# EAGLE design TUR8535 (EAGLE 7.2.0)
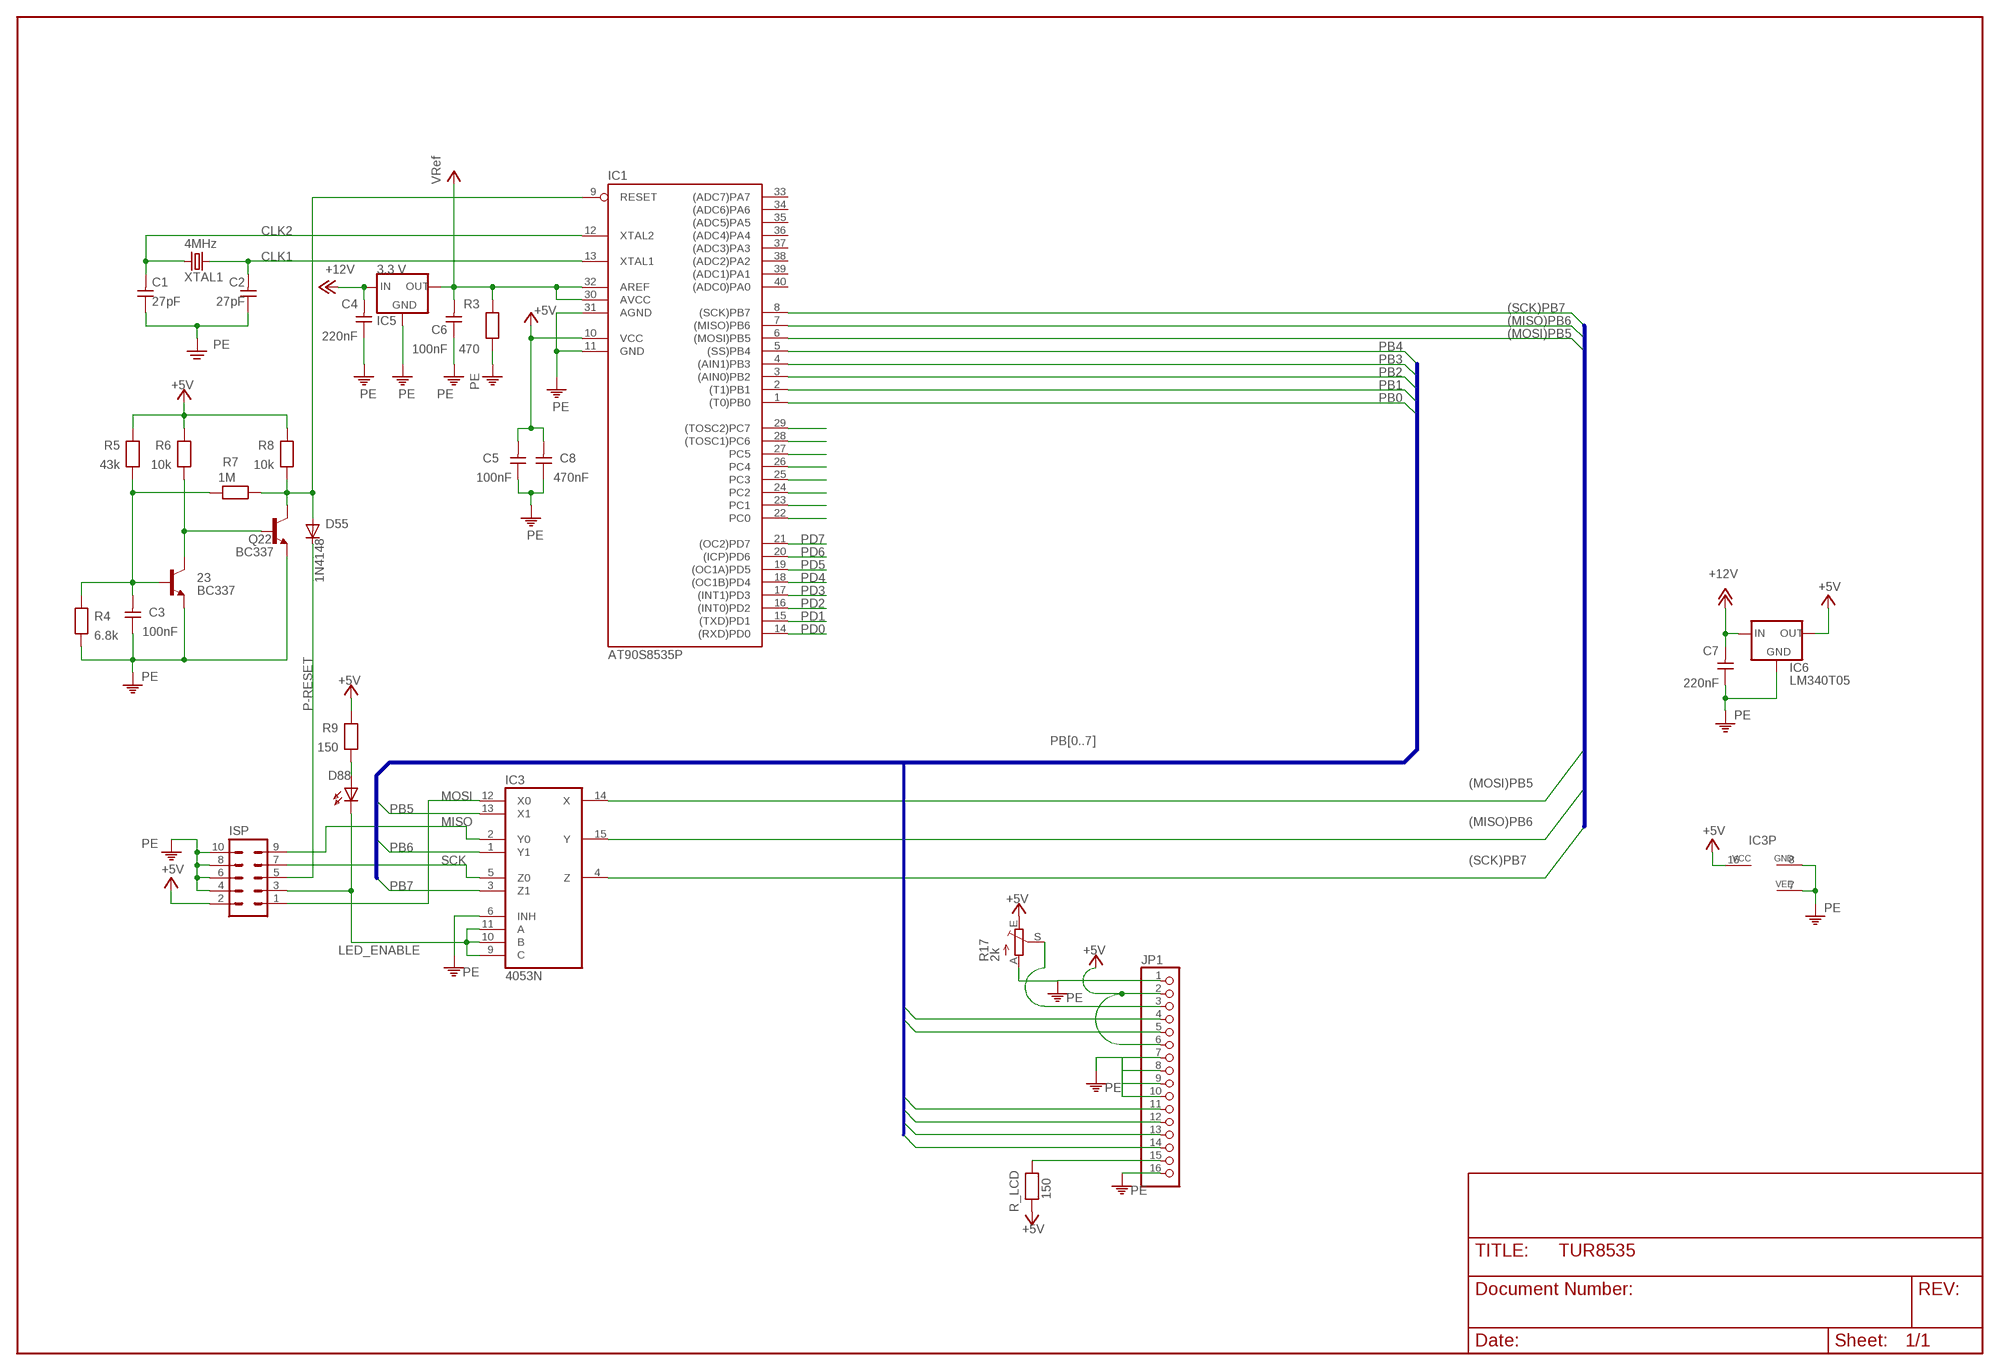
[diagram p0: schematic, sheet 1, part 1 of 2]
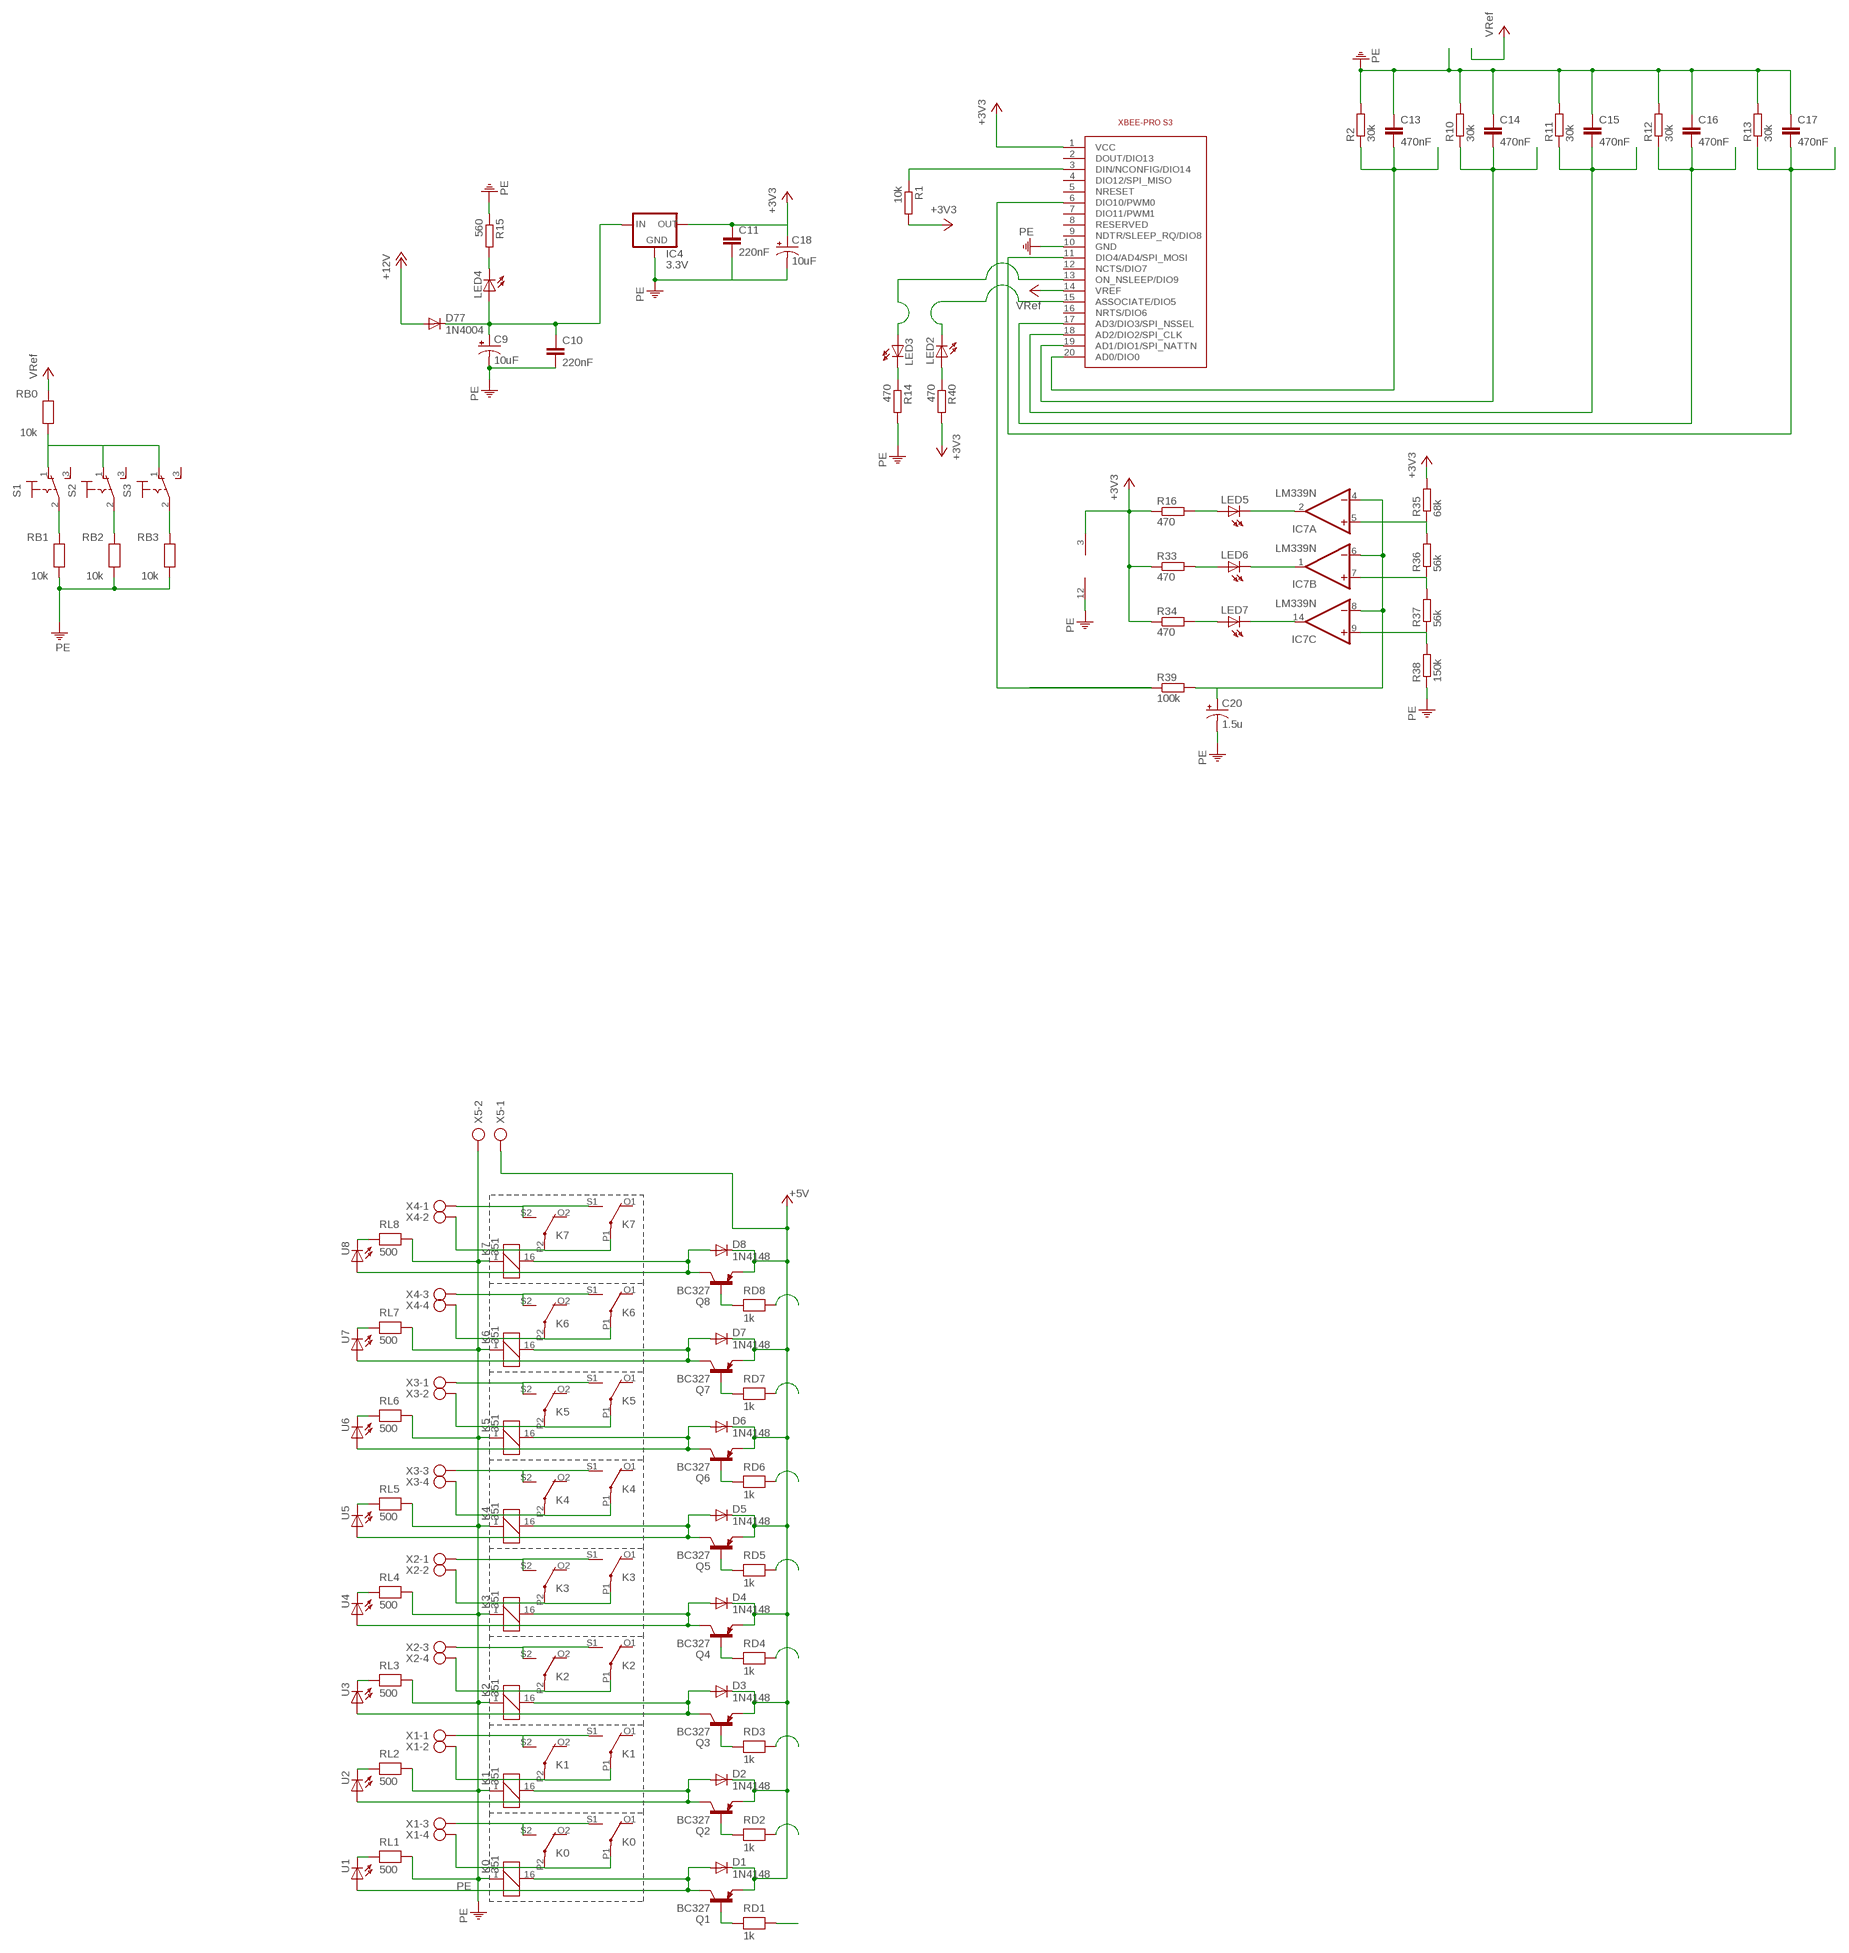
[diagram p1: schematic, sheet 1, part 2 of 2]

## Parts
23  BC337  [TO92]
C1  27pF  CAPNP-5  [C-5]
C2  27pF  CAPNP-5  [C-5]
C3  100nF  CAPNP-5  [C-5]
C4  220nF  CAPNP-5  [C-5]
C5  100nF  CAPNP-5  [C-5]
C6  100nF  CAPNP-5  [C-5]
C7  220nF  CAPNP-5  [C-5]
C8  470nF  CAPNP-5  [C-5]
C9  10uF  CPOL-USE2-5  [E2-5]
C10  220nF  C5/3.5  [C5B3.5]
C11  220nF  C5/3.5  [C5B3.5]
C13  470nF  C5/3.5  [C5B3.5]
C14  470nF  C5/3.5  [C5B3.5]
C15  470nF  C5/3.5  [C5B3.5]
C16  470nF  C5/3.5  [C5B3.5]
C17  470nF  C5/3.5  [C5B3.5]
C18  10uF  CPOL-USE2-5  [E2-5]
C20  1.5u  CPOL-USE2-5  [E2-5]
D1  1N4148  [DO35-10]
D2  1N4148  [DO35-10]
D3  1N4148  [DO35-10]
D4  1N4148  [DO35-10]
D5  1N4148  [DO35-10]
D6  1N4148  [DO35-10]
D7  1N4148  [DO35-10]
D8  1N4148  [DO35-10]
D55  1N4148  [DO35-10]
D77  1N4004  [DO41-10]
D88  LED5MM  [LED5MM]
IC1  AT90S8535P  [DIL40]
IC3  4053N  [DIL16]
IC4  3.3V  78XXL  [78XXL]
IC5  3.3 V  78XXL  [78XXL]
IC6  LM340T05  78XXL  [78XXL]
IC7  LM339N  [DIL14]
ISP  ML10  [ML10]
JP1  PINHD-1X16  [1X16]
K0  351  [351]
K1  351  [351]
K2  351  [351]
K3  351  [351]
K4  351  [351]
K5  351  [351]
K6  351  [351]
K7  351  [351]
LED2  LED3MM  [LED3MM]
LED3  LED3MM  [LED3MM]
LED4  LED5MM  [LED5MM]
LED5  LED3MM  [LED3MM]
LED6  LED3MM  [LED3MM]
LED7  LED3MM  [LED3MM]
Q1  BC327  [TO92-EBC]
Q2  BC327  [TO92-EBC]
Q3  BC327  [TO92-EBC]
Q4  BC327  [TO92-EBC]
Q5  BC327  [TO92-EBC]
Q6  BC327  [TO92-EBC]
Q7  BC327  [TO92-EBC]
Q8  BC327  [TO92-EBC]
Q22  BC337  [TO92]
R1  10k  R-EU_0207/7  [0207/7]
R2  30k  R-EU_0207/7  [0207/7]
R3  470  RESEU-10  [R-10]
R4  6.8k  RESEU-10  [R-10]
R5  43k  RESEU-10  [R-10]
R6  10k  RESEU-10  [R-10]
R7  1M  RESEU-10  [R-10]
R8  10k  RESEU-10  [R-10]
R9  150  RESEU-10  [R-10]
R10  30k  R-EU_0207/7  [0207/7]
R11  30k  R-EU_0207/7  [0207/7]
R12  30k  R-EU_0207/7  [0207/7]
R13  30k  R-EU_0207/7  [0207/7]
R14  470  R-EU_0207/7  [0207/7]
R15  560  R-EU_0207/7  [0207/7]
R16  470  R-EU_0207/7  [0207/7]
R17  2k  TRIM_EU-RJ9W  [RJ9W]
R33  470  R-EU_0207/7  [0207/7]
R34  470  R-EU_0207/7  [0207/7]
R35  68k  R-EU_0207/7  [0207/7]
R36  56k  R-EU_0207/7  [0207/7]
R37  56k  R-EU_0207/7  [0207/7]
R38  150k  R-EU_0207/7  [0207/7]
R39  100k  R-EU_0207/7  [0207/7]
R40  470  R-EU_0207/7  [0207/7]
R_LCD  150  RESEU-10  [R-10]
RB0  10k  RESEU-10  [R-10]
RB1  10k  RESEU-10  [R-10]
RB2  10k  RESEU-10  [R-10]
RB3  10k  RESEU-10  [R-10]
RD1  1k  RESEU-10  [R-10]
RD2  1k  RESEU-10  [R-10]
RD3  1k  RESEU-10  [R-10]
RD4  1k  RESEU-10  [R-10]
RD5  1k  RESEU-10  [R-10]
RD6  1k  RESEU-10  [R-10]
RD7  1k  RESEU-10  [R-10]
RD8  1k  RESEU-10  [R-10]
RL1  500  RESEU-10  [R-10]
RL2  500  RESEU-10  [R-10]
RL3  500  RESEU-10  [R-10]
RL4  500  RESEU-10  [R-10]
RL5  500  RESEU-10  [R-10]
RL6  500  RESEU-10  [R-10]
RL7  500  RESEU-10  [R-10]
RL8  500  RESEU-10  [R-10]
S1  320-916  [320-916]
S2  320-916  [320-916]
S3  320-916  [320-916]
U1  LED3MM  [LED3MM]
U2  LED3MM  [LED3MM]
U3  LED3MM  [LED3MM]
U4  LED3MM  [LED3MM]
U5  LED3MM  [LED3MM]
U6  LED3MM  [LED3MM]
U7  LED3MM  [LED3MM]
U8  LED3MM  [LED3MM]
U$1  XBEEPRO900  [XBEE-PRO]
X1  AK500/4-H  [AK500/4-H]
X2  AK500/4-H  [AK500/4-H]
X3  AK500/4-H  [AK500/4-H]
X4  AK500/4-H  [AK500/4-H]
X5  AK500/2  [AK500/2]
XTAL1  4MHz  CRYTALHC18U-V  [HC18U-V]

## Nets
(MISO)PB6: IC1.7((MISO)PB6) IC3.15(Y)
(MOSI)PB5: IC1.6((MOSI)PB5) IC3.14(X)
(SCK)PB7: IC1.8((SCK)PB7) IC3.4(Z)
+3V3: C11.1 C18.+ IC4.OUT IC7.3(P:V+) R1.2 R16.1 R33.1 R34.1 R35.2 R40.2 U$1.1(VCC)
+5V: C5.2 C8.2 D1.C D2.C D3.C D4.C D5.C D6.C D7.C D8.C IC1.10(VCC) IC3.16(VCC) IC6.OUT ISP.2 JP1.2 JP1.6 Q1.E Q2.E Q3.E Q4.E Q5.E Q6.E Q7.E Q8.E R5.2 R6.2 R8.2 R9.2 R17.E R_LCD.2 X5.1
+12V: C4.2 C7.2 D77.A IC5.IN IC6.IN
CLK1: C2.2 IC1.13(XTAL1) XTAL1.2
CLK2: C1.2 IC1.12(XTAL2) XTAL1.1
DIN: R1.1 U$1.3(DIN/NCONFIG/DIO14)
LED_ENABLE: D88.K(C) IC3.9(C) IC3.10(B) IC3.11(A) ISP.3
MISO: IC3.2(Y0) ISP.9
MOSI: IC3.12(X0) ISP.1
N$1: C17.2 R13.1 U$1.11(DIO4/AD4/SPI_MOSI)
N$2: C9.+ C10.1 D77.C IC4.IN LED4.A
N$3: C13.2 R2.1 U$1.20(AD0/DIO0)
N$4: C14.2 R10.1 U$1.19(AD1/DIO1/SPI_NATTN)
N$5: C15.2 R11.1 U$1.18(AD2/DIO2/SPI_CLK)
N$6: C16.2 R12.1 U$1.17(AD3/DIO3/SPI_NSSEL)
N$7: 23.3(C) Q22.2(B) R6.1
N$8: IC7.2(A:OUT) LED5.K(C)
N$9: 23.2(B) C3.2 R4.2 R5.1 R7.1
N$10: Q8.B RD8.1
N$11: IC7.1(B:OUT) LED6.K(C)
N$12: D7.A K6.16 Q7.C U7.A
N$13: Q6.B RD6.1
N$14: LED3.K(C) R14.1
N$15: LED4.K(C) R15.2
N$16: IC7.14(C:OUT) LED7.K(C)
N$17: D6.A K5.16 Q6.C U6.A
N$18: Q5.B RD5.1
N$19: D88.A R9.1
N$20: D5.A K4.16 Q5.C U5.A
N$21: Q4.B RD4.1
N$22: D4.A K3.16 Q4.C U4.A
N$23: Q3.B RD3.1
N$24: D3.A K2.16 Q3.C U3.A
N$25: Q2.B RD2.1
N$26: K0.P1(2:P) K0.P2(3:P) X1.4
N$27: K1.P1(2:P) K1.P2(3:P) X1.2
N$28: K2.P1(2:P) K2.P2(3:P) X2.4
N$29: K3.P1(2:P) K3.P2(3:P) X2.2
N$30: K4.P1(2:P) K4.P2(3:P) X3.4
N$31: K5.P1(2:P) K5.P2(3:P) X3.2
N$32: K6.P1(2:P) K6.P2(3:P) X4.4
N$33: K7.P1(2:P) K7.P2(3:P) X4.2
N$34: K7.S1(2:S) K7.S2(3:S) X4.1
N$35: JP1.15 R_LCD.1
N$36: K5.S1(2:S) K5.S2(3:S) X3.1
N$37: K4.S1(2:S) K4.S2(3:S) X3.3
N$38: K3.S1(2:S) K3.S2(3:S) X2.1
N$39: K2.S1(2:S) K2.S2(3:S) X2.3
N$40: K1.S1(2:S) K1.S2(3:S) X1.1
N$41: K0.S1(2:S) K0.S2(3:S) X1.3
N$42: K6.S1(2:S) K6.S2(3:S) X4.3
N$43: JP1.3 R17.S
N$44: RB0.1 S1.1(O) S2.1(O) S3.1(O)
N$45: RB1.2 S1.2(P)
N$46: RB2.2 S2.2(P)
N$47: RB3.2 S3.2(P)
N$52: D8.A K7.16 Q8.C U8.A
N$54: Q7.B RD7.1
N$55: LED7.A R34.2
N$56: LED6.A R33.2
N$57: LED5.A R16.2
N$58: IC7.5(A:+IN) R35.1 R36.2
N$59: IC7.7(B:+IN) R36.1 R37.2
N$60: IC7.9(C:+IN) R37.1 R38.2
N$61: C20.+ IC7.4(A:-IN) IC7.6(B:-IN) IC7.8(C:-IN) R39.2
N$62: LED3.A U$1.13(ON_NSLEEP/DIO9)
N$63: R39.1 U$1.6(DIO10/PWM0)
N$64: LED2.K(C) U$1.15(ASSOCIATE/DIO5)
N$65: LED2.A R40.1
N$66: D2.A K1.16 Q2.C U2.A
N$67: Q1.B RD1.1
N$68: D1.A K0.16 Q1.C U1.A
N$96: RL1.1 U1.K(C)
N$163: RL8.1 U8.K(C)
N$165: RL7.1 U7.K(C)
N$169: RL6.1 U6.K(C)
N$171: RL5.1 U5.K(C)
N$174: RL4.1 U4.K(C)
N$177: RL3.1 U3.K(C)
N$180: RL2.1 U2.K(C)
P-RESET: D55.C ISP.5
PB0: IC1.1((T0)PB0) JP1.5
PB1: IC1.2((T1)PB1) JP1.4
PB2: IC1.3((AIN0)PB2)
PB3: IC1.4((AIN1)PB3)
PB4: IC1.5((SS)PB4) JP1.11
PB5: IC3.13(X1) JP1.12
PB6: IC3.1(Y1) JP1.13
PB7: IC3.3(Z1) JP1.14
PC0: IC1.22(PC0) RD8.2
PC1: IC1.23(PC1) RD7.2
PC2: IC1.24(PC2) RD6.2
PC3: IC1.25(PC3) RD5.2
PC4: IC1.26(PC4) RD4.2
PC5: IC1.27(PC5) RD3.2
PC6: IC1.28((TOSC1)PC6) RD2.2
PC7: IC1.29((TOSC2)PC7) RD1.2
PE: 23.1(E) C1.1 C2.1 C3.1 C4.1 C5.1 C6.1 C7.1 C8.1 C9.- C10.2 C11.2 C13.1 C14.1 C15.1 C16.1 C17.1 C18.- C20.- IC1.11(GND) IC1.31(AGND) IC3.6(INH) IC3.7(VEE) IC3.8(GND) IC4.GND IC5.GND IC6.GND IC7.12(P:GND) ISP.4 ISP.6 ISP.8 ISP.10 JP1.1 JP1.7 JP1.8 JP1.9 JP1.10 JP1.16 K0.1 K1.1 K2.1 K3.1 K4.1 K5.1 K6.1 K7.1 Q22.1(E) R2.2 R3.1 R4.1 R10.2 R11.2 R12.2 R13.2 R14.2 R15.1 R17.A R38.1 RB1.1 RB2.1 RB3.1 RL1.2 RL2.2 RL3.2 RL4.2 RL5.2 RL6.2 RL7.2 RL8.2 U$1.10(GND) X5.2
RST: D55.A IC1.9(RESET) Q22.3(C) R7.2 R8.1
SCK: IC3.5(Z0) ISP.7
VCC: C6.2 IC1.30(AVCC) IC1.32(AREF) IC5.OUT R3.2 RB0.2 U$1.14(VREF) ; supply symbol labelled VRef
Unconnected: IC1.14((RXD)PD0) IC1.15((TXD)PD1) IC1.16((INT0)PD2) IC1.17((INT1)PD3) IC1.18((OC1B)PD4) IC1.19((OC1A)PD5) IC1.20((ICP)PD6) IC1.21((OC2)PD7) IC1.33((ADC7)PA7) IC1.34((ADC6)PA6) IC1.35((ADC5)PA5) IC1.36((ADC4)PA4) IC1.37((ADC3)PA3) IC1.38((ADC2)PA2) IC1.39((ADC1)PA1) IC1.40((ADC0)PA0) IC7.10(D:-IN) IC7.11(D:+IN) IC7.13(D:OUT) K0.O1(2:O) K0.O2(3:O) K1.O1(2:O) K1.O2(3:O) K2.O1(2:O) K2.O2(3:O) K3.O1(2:O) K3.O2(3:O) K4.O1(2:O) K4.O2(3:O) K5.O1(2:O) K5.O2(3:O) K6.O1(2:O) K6.O2(3:O) K7.O1(2:O) K7.O2(3:O) S1.3(S) S2.3(S) S3.3(S) U$1.2(DOUT/DIO13) U$1.4(DIO12/SPI_MISO) U$1.5(NRESET) U$1.7(DIO11/PWM1) U$1.8(RESERVED) U$1.9(NDTR/SLEEP_RQ/DIO8) U$1.12(NCTS/DIO7) U$1.16(NRTS/DIO6)

## Buses
PB[0..7]
(SCK)PB7,(MISO)PB6,(MOSI)PB5

## Library data of the parts
23 Q22 = transistor-npn:BC337*: NPN Transistor
C1-C8 = discrete:CAPNP-5
C9 C18 C20 = rcl:CPOL-US: POLARIZED CAPACITOR, American symbol
C10 C11 C13-C17 = capacitor-wima:C: CAPACITOR naming: grid - package width
D1-D8 D55 = diode:1N4148: DIODE high speed (Philips)
D77 = diode:1N4004: DIODE general purpose rectifier, 1 A
D88 LED2-LED7 U1-U8 = led:LED: LED
IC1 = atmel:AT90*8535P: MICROCONTROLLER 8 Kbytes FLASH 512 bytes SRAM 512 bytes EEPROM UART 8-channel 10 bit ADC
IC3 = 40xx:4053: Triple 2-channel ANALOG MULTIPLEXER
IC4-IC6 = v-reg:78XXL: VOLTAGE REGULATOR
IC7 = linear:LM339: Low Power Low Offset Voltage Quad Comparators with open collector; LM139/LM239/LM339/LM2901/LM3302
ISP = con-harting-ml:ML10: HARTING
JP1 = pinhead:PINHD-1X16: PIN HEADER
K0 K1-K7 = relay:351: RELAY 2 x switch, Omron
Q1-Q8 = transistor-pnp:BC327*: PNP Transistror
R1 R2 R10-R16 R33-R40 = resistor:R-EU_: RESISTOR, European symbol
R3-R9 R_LCD RB0 RB1-RB3 RD1-RD8 RL1-RL8 = discrete:RESEU-10
R17 = pot:TRIM_EU-: POTENTIOMETER
S1-S3 = switch:320-916: TOGGLE SWITCH distributor RS Components
U$1 = maxstream2:XBEEPRO900
X1-X4 = con-ptr500:AK500/4-H: CONNECTOR Aug. 2004 / PTR Meßtechnik: Die Bezeichnung der Serie AK505 wurde geändert. Es handelt sich hierbei um AK500 in horizontaler Ausführung.; OC_FARNELL: unknown; OC_NEWARK: unknown
X5 = con-ptr500:AK500/2: CONNECTOR; OC_FARNELL: unknown; OC_NEWARK: unknown
XTAL1 = crystal:CRYTAL: CRYSTAL

## Board
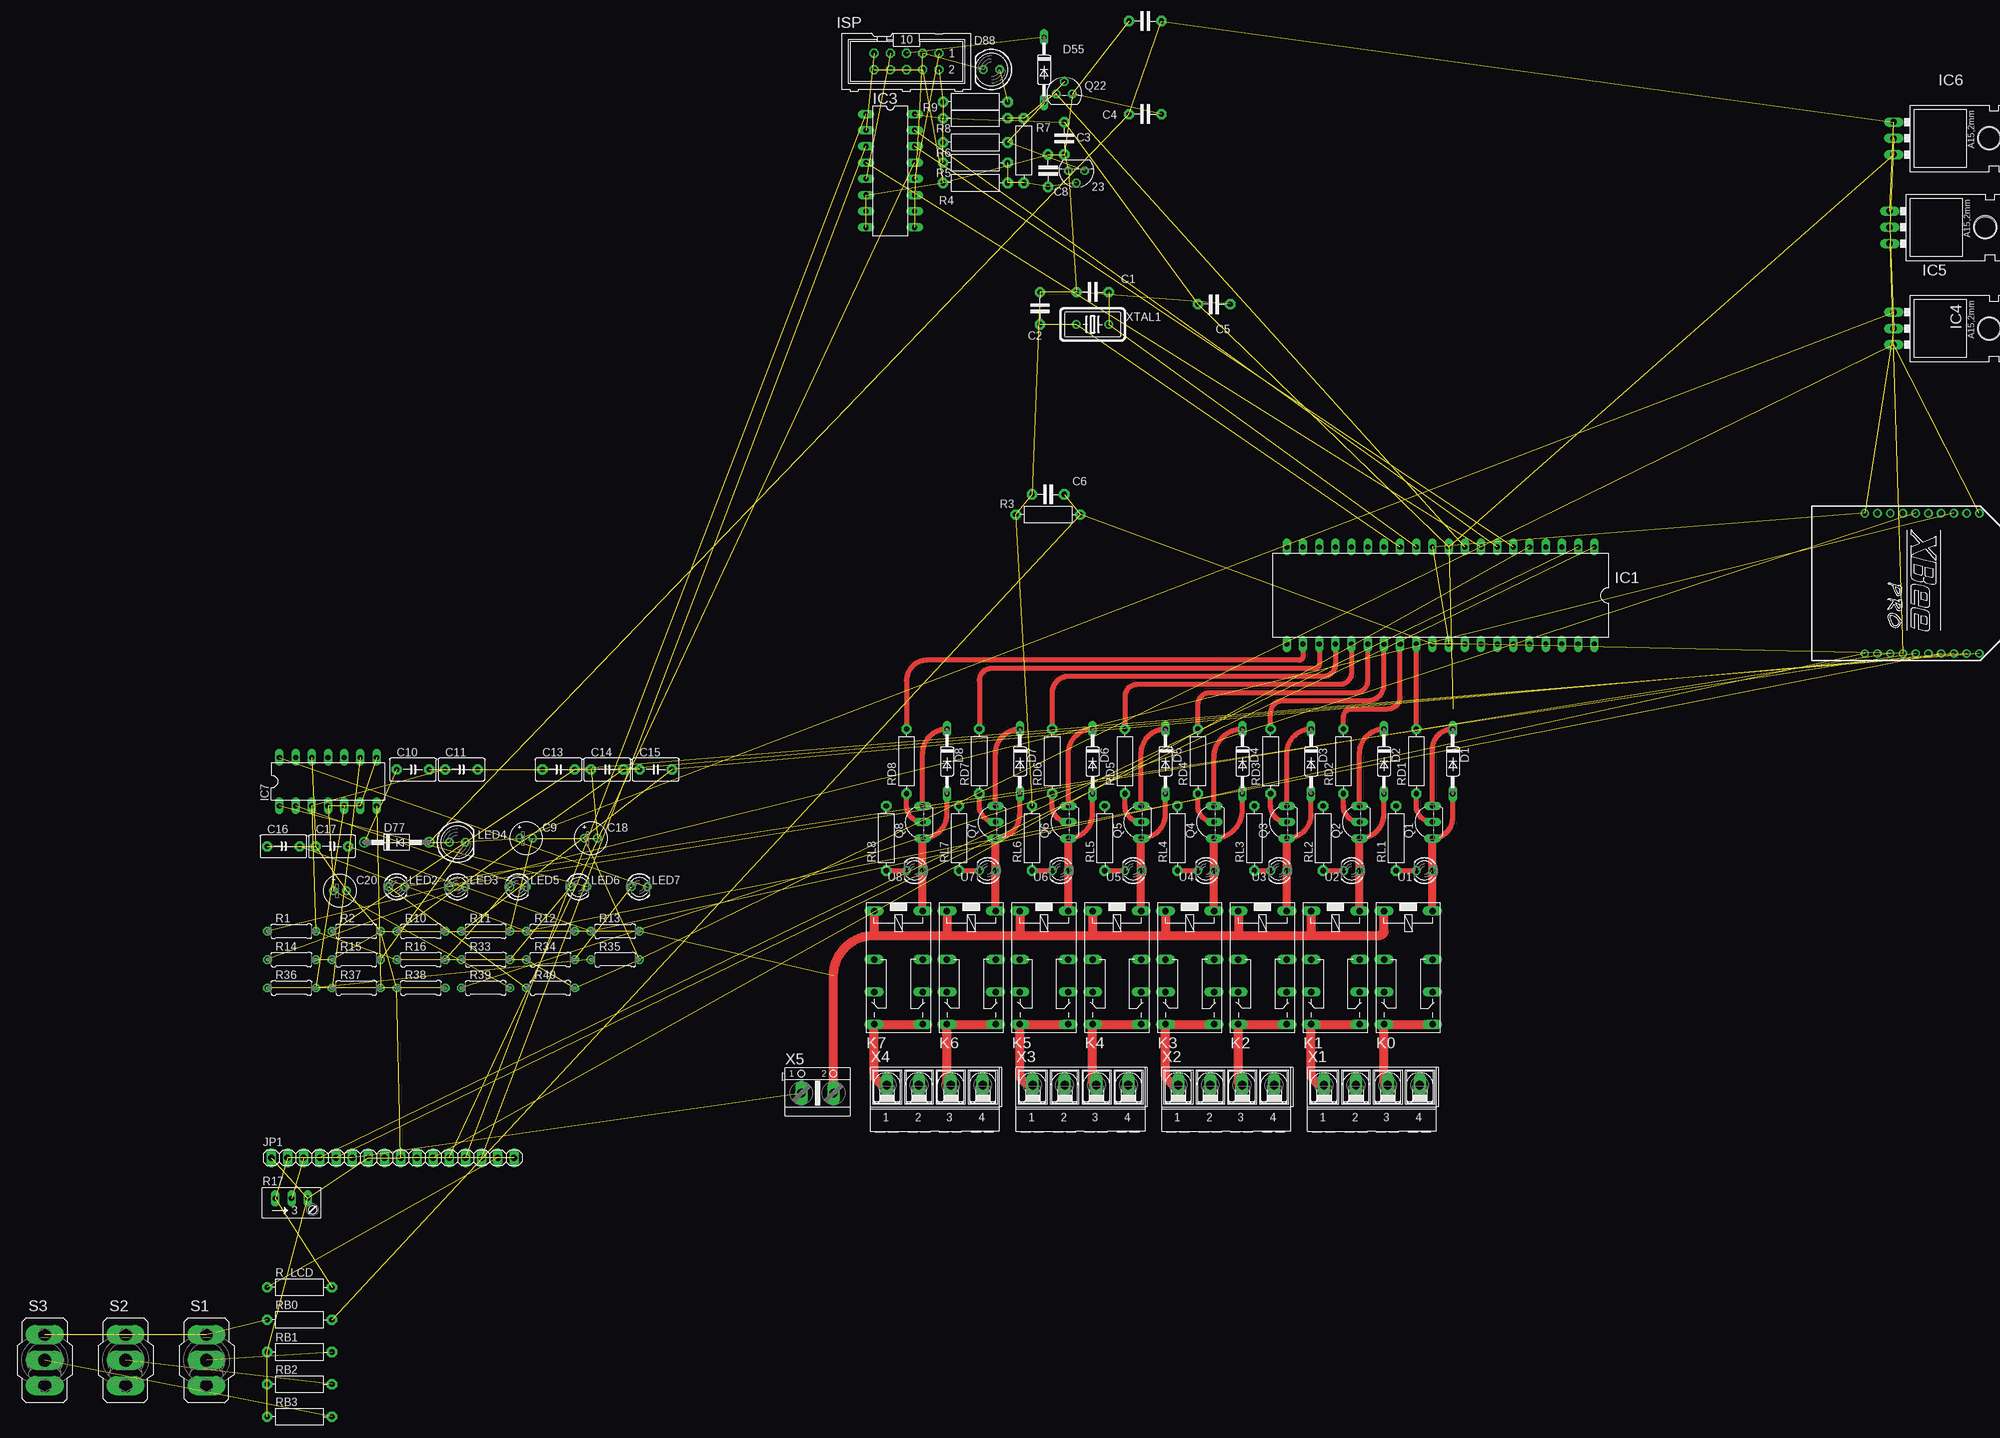
[diagram p2: board, top side]
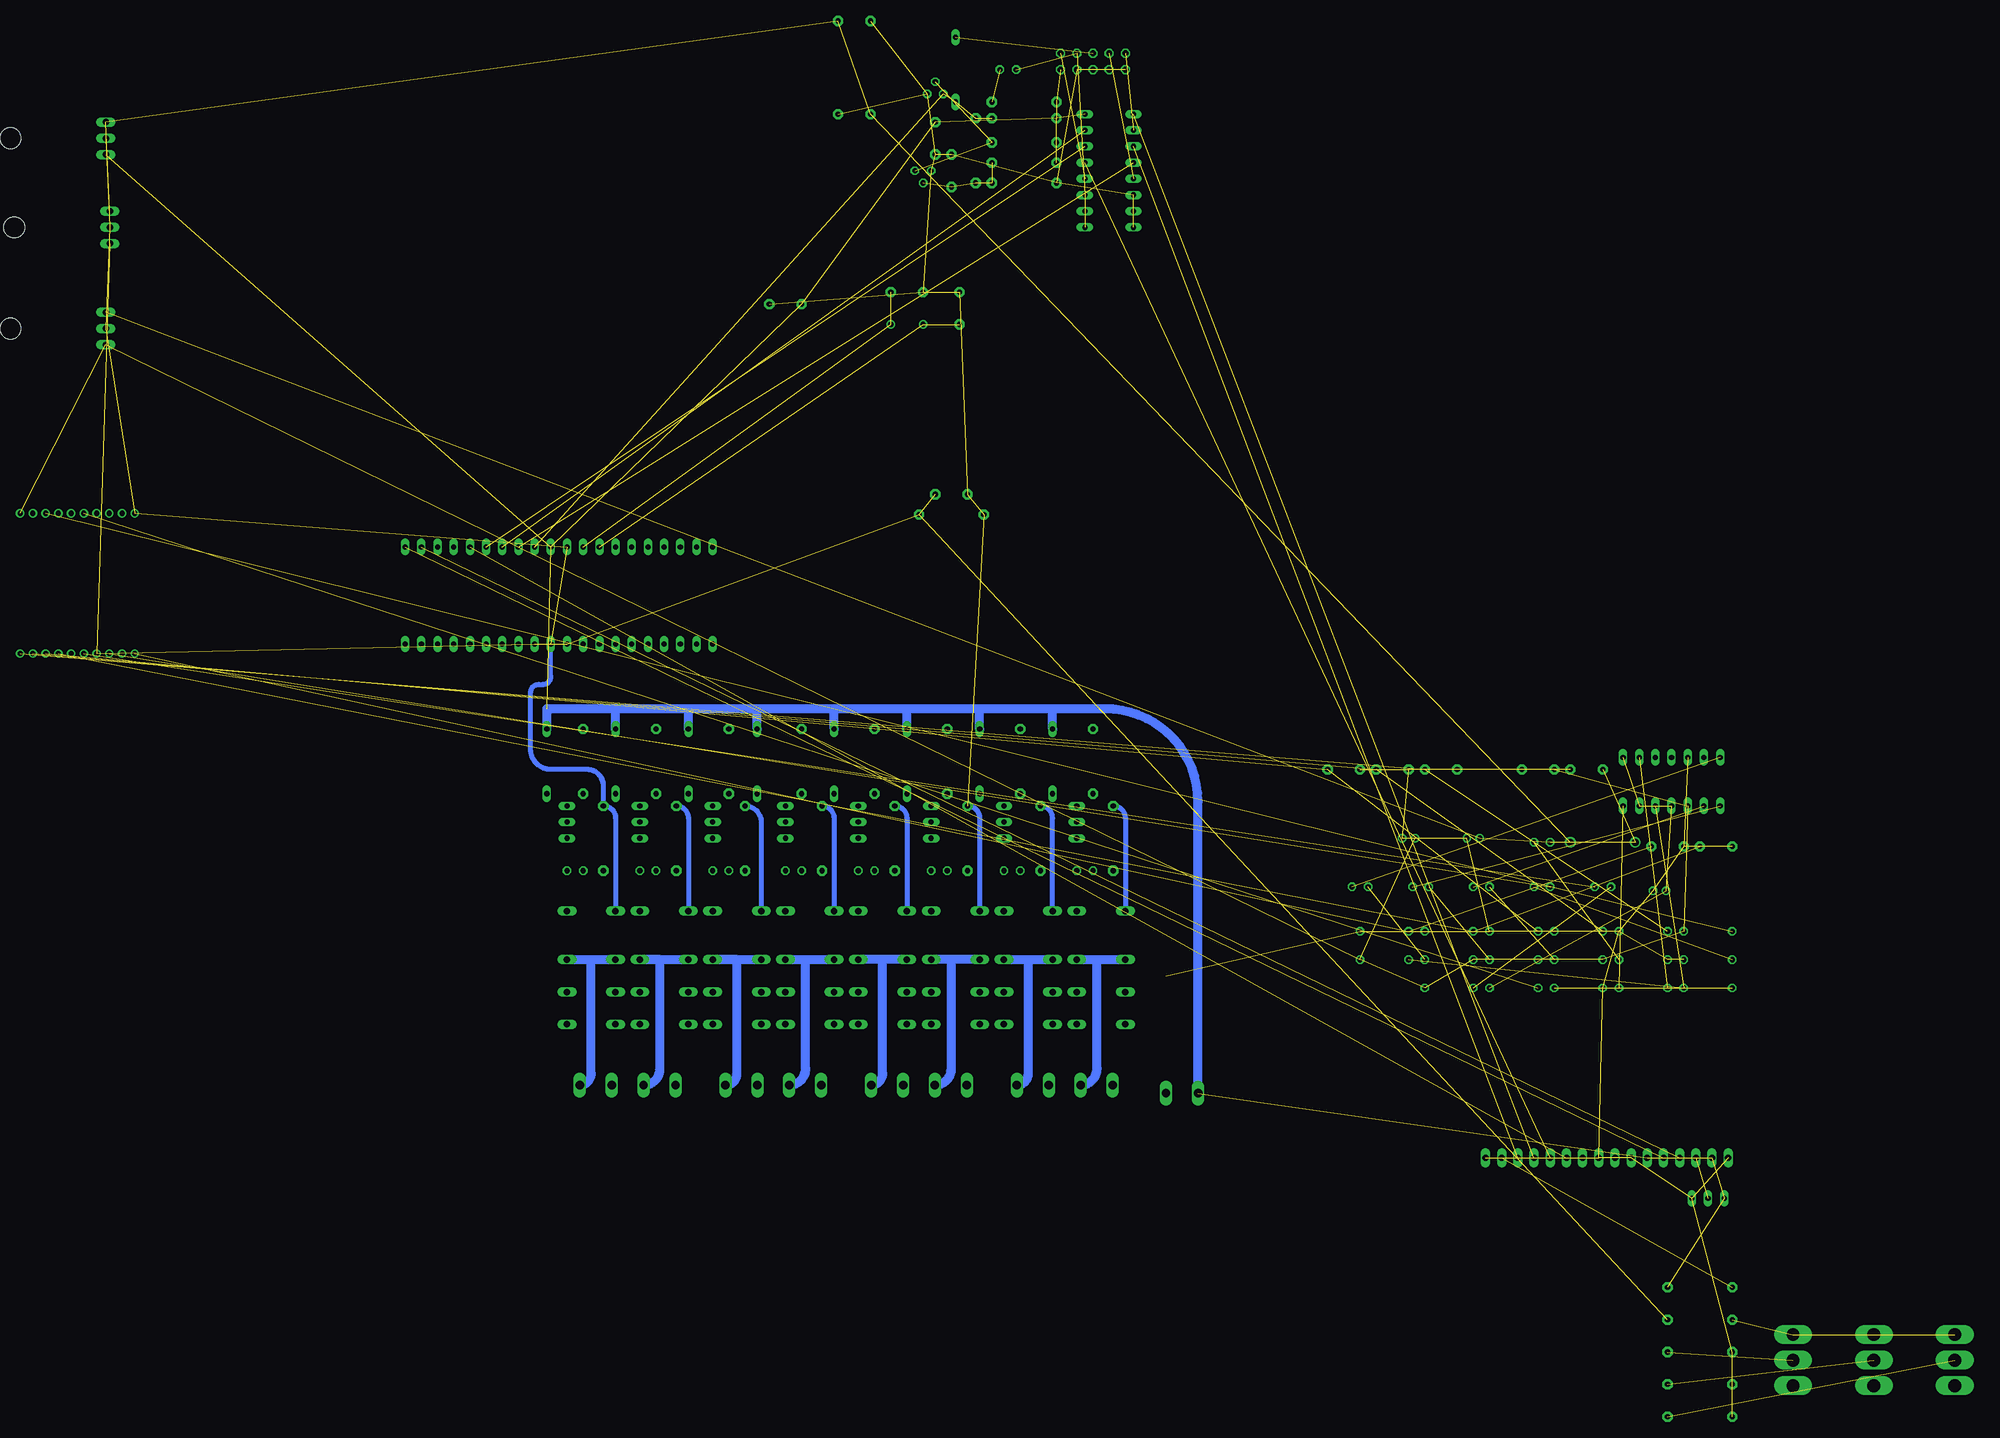
[diagram p3: board, bottom side, seen from below]

No outline drawn. Coordinates in mm, seen from the top.
Copper layers (1*16): Top 0.035mm / dielectric 1.5mm / Bottom 0.035mm
Design rules "terminal": minimum track width 16mil, minimum drill 24mil, track to track 12mil, track to pad 12mil, pad to pad 12mil, via to via 12mil, smd to smd 0mil, copper to edge 40mil, drill to drill 12mil, minimum pad ring 10mil, minimum via ring 8mil, stop-mask expansion 4mil, vias tented up to drill 0mil, thermal gap 10mil

### Footprints (pad centres in the part's own frame; a part is rotated, then mirrored left to right if it is on the bottom)
TO92 = drill 0.813 octagon: 1 1.27,0; 2 0,1.905; 3 -1.27,0
C-5 = drill 0.813 pad 1.6 octagon: 1 -2.54,0; 2 2.54,0
E2-5 = drill 0.813 pad 1.27: + -1.016,0 | drill 0.813 pad 1.27 octagon: - 1.016,0
C5B3.5 = drill 0.813 pad 1.6 octagon: 1 -2.54,0; 2 2.54,0
DO35-10 = drill 0.813 long: A 5.08,0; C -5.08,0
DO41-10 = drill 1.118: A 5.08,0; C -5.08,0
LED5MM = drill 0.813 octagon: A -1.27,0; K 1.27,0
DIL40 = drill 0.813 long: 1 -24.13,-7.62; 2 -21.59,-7.62; 3 -19.05,-7.62; 4 -16.51,-7.62; 5 -13.97,-7.62; 6 -11.43,-7.62; 7 -8.89,-7.62; 8 -6.35,-7.62; 9 -3.81,-7.62; 10 -1.27,-7.62; 11 1.27,-7.62; 12 3.81,-7.62; 13 6.35,-7.62; 14 8.89,-7.62; 15 11.43,-7.62; 16 13.97,-7.62; 17 16.51,-7.62; 18 19.05,-7.62; 19 21.59,-7.62; 20 24.13,-7.62; 21 24.13,7.62; 22 21.59,7.62; 23 19.05,7.62; 24 16.51,7.62; 25 13.97,7.62; 26 11.43,7.62; 27 8.89,7.62; 28 6.35,7.62; 29 3.81,7.62; 30 1.27,7.62; 31 -1.27,7.62; 32 -3.81,7.62; 33 -6.35,7.62; 34 -8.89,7.62; 35 -11.43,7.62; 36 -13.97,7.62; 37 -16.51,7.62; 38 -19.05,7.62; 39 -21.59,7.62; 40 -24.13,7.62
DIL16 = drill 0.813 long: 1 -8.89,-3.81; 2 -6.35,-3.81; 3 -3.81,-3.81; 4 -1.27,-3.81; 5 1.27,-3.81; 6 3.81,-3.81; 7 6.35,-3.81; 8 8.89,-3.81; 9 8.89,3.81; 10 6.35,3.81; 11 3.81,3.81; 12 1.27,3.81; 13 -1.27,3.81; 14 -3.81,3.81; 15 -6.35,3.81; 16 -8.89,3.81
78XXL = drill 1.016 long: GND 0,-3.81; IN -2.54,-3.81; OUT 2.54,-3.81 | hole 3.302: 0,11.176
DIL14 = drill 0.813 long: 1 -7.62,-3.81; 2 -5.08,-3.81; 3 -2.54,-3.81; 4 0,-3.81; 5 2.54,-3.81; 6 5.08,-3.81; 7 7.62,-3.81; 8 7.62,3.81; 9 5.08,3.81; 10 2.54,3.81; 11 0,3.81; 12 -2.54,3.81; 13 -5.08,3.81; 14 -7.62,3.81
ML10 = drill 0.914 octagon: 1 -5.08,-1.27; 2 -5.08,1.27; 3 -2.54,-1.27; 4 -2.54,1.27; 5 0,-1.27; 6 0,1.27; 7 2.54,-1.27; 8 2.54,1.27; 9 5.08,-1.27; 10 5.08,1.27
1X16 = drill 1.016 long: 1 -19.05,0; 2 -16.51,0; 3 -13.97,0; 4 -11.43,0; 5 -8.89,0; 6 -6.35,0; 7 -3.81,0; 8 -1.27,0; 9 1.27,0; 10 3.81,0; 11 6.35,0; 12 8.89,0; 13 11.43,0; 14 13.97,0; 15 16.51,0; 16 19.05,0
351 = drill 1.016 long: 1 -3.81,-3.81; 16 -3.81,3.81; O1 8.89,-3.81; O2 8.89,3.81; P1 3.81,-3.81; P2 3.81,3.81; S1 13.97,-3.81; S2 13.97,3.81
LED3MM = drill 0.813 octagon: A -1.27,0; K 1.27,0
TO92-EBC = drill 0.813 long: B 0,-1.27; C -2.54,-1.27; E 2.54,-1.27
0207/7 = drill 0.813 octagon: 1 -3.81,0; 2 3.81,0
R-10 = drill 0.813 pad 1.6 octagon: 1 -5.08,0; 2 5.08,0
RJ9W = drill 0.813 long: A 2.54,0.635; E -2.54,0.635; S 0,0.635
320-916 = drill 2.007 long: 1 0,4.013; 2 0,0; 3 0,-4.013
XBEE-PRO = drill 0.8 pad 1.27: 1 -11,9; 2 -11,7; 3 -11,5; 4 -11,3; 5 -11,1; 6 -11,-1; 7 -11,-3; 8 -11,-5; 9 -11,-7; 10 -11,-9; 11 11,-9; 12 11,-7; 13 11,-5; 14 11,-3; 15 11,-1; 16 11,1; 17 11,3; 18 11,5; 19 11,7; 20 11,9
AK500/4-H = drill 1.321 long: 1 -7.518,0; 2 -2.489,0; 3 2.489,0; 4 7.518,0
AK500/2 = drill 1.321 long: 1 -2.515,0; 2 2.515,0
HC18U-V = drill 0.813: 1 -2.54,0; 2 2.54,0

### Placement (x,y rotation side)
23  130.18,-196.85 180 top
C1  132.72,-215.9 0 top
C2  124.46,-218.44 270 top
C3  125.73,-196.85 270 top
C4  140.97,-187.96 180 top
C5  151.76,-217.81 180 top
C6  125.73,-247.65 0 top
C7  140.97,-173.35 0 top
C8  128.27,-191.77 90 top
C9  43.81,-301.62 0 top
C10  26.04,-290.83 0 top
C11  33.66,-290.83 0 top
C13  48.9,-290.83 0 top
C14  56.52,-290.83 0 top
C15  64.14,-290.83 0 top
C16  5.71,-302.89 0 top
C17  13.34,-302.89 0 top
C18  53.98,-301.62 0 top
C20  14.61,-309.88 0 top
D1  189.23,-289.56 270 top
D2  178.44,-289.56 270 top
D3  167,-289.56 270 top
D4  156.21,-289.56 270 top
D5  144.15,-289.56 270 top
D6  132.72,-289.56 270 top
D7  121.28,-289.56 270 top
D8  109.86,-289.56 270 top
D55  125.09,-180.97 270 top
D77  23.5,-302.26 0 top
D88  116.84,-180.97 180 top
IC1  187.32,-263.52 180 top
IC3  100.97,-196.85 270 top
IC4  262.25,-221.62 270 top
IC5  261.62,-205.74 270 top
IC6  262.25,-191.77 270 top
IC7  12.7,-292.74 0 top
ISP  103.5,-179.71 180 top
JP1  22.86,-351.79 0 top
K0  182.25,-316.87 270 top
K1  170.81,-316.87 270 top
K2  159.38,-316.87 270 top
K3  147.96,-316.87 270 top
K4  136.53,-316.87 270 top
K5  125.09,-316.87 270 top
K6  113.67,-316.87 270 top
K7  102.23,-316.87 270 top
LED2  23.5,-309.25 0 top
LED3  33.02,-309.25 0 top
LED4  33.02,-302.26 0 top
LED5  42.55,-309.25 0 top
LED6  52.07,-309.25 0 top
LED7  61.59,-309.25 0 top
Q1  184.78,-299.08 90 top
Q2  173.35,-299.08 90 top
Q3  161.93,-299.08 90 top
Q4  150.5,-299.08 90 top
Q5  139.06,-299.08 90 top
Q6  127.64,-299.08 90 top
Q7  116.2,-299.08 90 top
Q8  104.78,-299.08 90 top
Q22  128.27,-184.78 0 top
R1  6.99,-316.23 0 top
R2  17.14,-316.23 0 top
R3  125.73,-250.82 0 top
R4  114.3,-198.75 0 top
R5  114.3,-195.58 180 top
R6  114.3,-192.41 180 top
R7  121.92,-193.68 90 top
R8  114.3,-188.59 180 top
R9  114.3,-186.06 180 top
R10  27.3,-316.23 0 top
R11  37.47,-316.23 0 top
R12  47.62,-316.23 0 top
R13  57.78,-316.23 0 top
R14  6.99,-320.68 0 top
R15  17.14,-320.68 0 top
R16  27.3,-320.68 0 top
R17  6.99,-358.77 0 top
R33  37.47,-320.68 0 top
R34  47.62,-320.68 0 top
R35  57.78,-320.68 0 top
R36  6.99,-325.12 0 top
R37  17.14,-325.12 0 top
R38  27.3,-325.12 0 top
R39  37.47,-325.12 0 top
R40  47.62,-325.12 0 top
R_LCD  8.26,-372.11 0 top
RB0  8.26,-377.19 0 top
RB1  8.26,-382.27 0 top
RB2  8.26,-387.35 0 top
RB3  8.26,-392.43 0 top
RD1  183.51,-289.56 90 top
RD2  172.09,-289.56 90 top
RD3  160.66,-289.56 90 top
RD4  149.22,-289.56 90 top
RD5  137.79,-289.56 90 top
RD6  126.36,-289.56 90 top
RD7  114.94,-289.56 90 top
RD8  103.5,-289.56 90 top
RL1  180.34,-301.62 90 top
RL2  168.91,-301.62 90 top
RL3  158.12,-301.62 90 top
RL4  146.05,-301.62 90 top
RL5  134.62,-301.62 90 top
RL6  123.19,-301.62 90 top
RL7  111.76,-301.62 90 top
RL8  100.33,-301.62 90 top
S1  -6.35,-383.54 0 top
S2  -19.05,-383.54 0 top
S3  -31.75,-383.54 0 top
U1  184.78,-306.7 180 top
U2  173.35,-306.7 180 top
U3  161.93,-306.7 180 top
U4  150.5,-306.7 180 top
U5  139.06,-306.7 180 top
U6  127.64,-306.7 180 top
U7  116.2,-306.7 180 top
U8  104.78,-306.7 180 top
U$1  262.89,-261.62 270 top
X1  176.53,-340.36 0 top
X2  153.67,-340.36 0 top
X3  130.81,-340.36 0 top
X4  107.95,-340.36 0 top
X5  89.53,-341.63 0 top
XTAL1  132.72,-220.98 180 top

### Tracks (layer width: path | path; a pad name or v marks a point on that pad's centre or on a via)
(MISO)PB6  (1 unrouted)
(MOSI)PB5  (1 unrouted)
(SCK)PB7  (1 unrouted)
+3V3  (10 unrouted)
+5V  (14 unrouted)
  Top 0.813: Q8.E 106.05,-288.29 arc-90 D8.C | Q7.E 117.47,-288.29 arc-90 D7.C | Q6.E 128.91,-288.29 arc-90 D6.C | Q4.E 151.76,-288.93 arc-90 D4.C | Q3.E 163.19,-288.29 arc-90 D3.C | Q2.E 174.62,-288.29 arc-90 D2.C | Q1.E 186.06,-287.65 arc-90 D1.C | Q5.E 140.34,-288.29 arc-90 D5.C
  Bottom 0.813: 109.86,-281.31 110.49,-281.31
  Bottom 1.422: D8.C 109.86,-281.31 | 121.28,-281.31 110.49,-281.31 101.6,-281.31 arc90 87.02,-295.88 X5.1 | 121.28,-281.31 132.72,-281.31 | 132.72,-281.31 144.15,-281.31 | 144.15,-281.31 156.21,-281.31 | 156.21,-281.31 167,-281.31 | 167,-281.31 178.44,-281.31 | 178.44,-281.31 189.23,-281.31 D1.C | D7.C 121.28,-281.31 | D6.C 132.72,-281.31 | D2.C 178.44,-281.31 | D3.C 167,-281.31 | D4.C 156.21,-281.31 | D5.C 144.15,-281.31
+12V  (4 unrouted)
CLK1  (2 unrouted)
CLK2  (2 unrouted)
DIN  (1 unrouted)
LED_ENABLE  (4 unrouted)
MISO  (1 unrouted)
MOSI  (1 unrouted)
N$1  (2 unrouted)
N$2  (4 unrouted)
N$3  (2 unrouted)
N$4  (2 unrouted)
N$5  (2 unrouted)
N$6  (2 unrouted)
N$7  (2 unrouted)
N$8  (1 unrouted)
N$9  (4 unrouted)
N$10
  Top 0.813: Q8.B arc-90 103.5,-296.55 RD8.1
N$11  (1 unrouted)
N$12
  Top 0.813: Q7.C arc90 121.28,-297.81 D7.A
  Top 1.27: K6.16 U7.A Q7.C
N$13
  Top 0.813: Q6.B arc-90 126.36,-296.55 RD6.1
N$14  (1 unrouted)
N$15  (1 unrouted)
N$16  (1 unrouted)
N$17
  Top 0.813: Q6.C arc90 132.72,-297.81 D6.A
  Top 1.27: K5.16 U6.A Q6.C
N$18
  Top 0.813: Q5.B arc-90 137.79,-296.55 RD5.1
N$19  (1 unrouted)
N$20
  Top 0.813: Q5.C arc90 144.15,-297.81 D5.A
  Top 1.27: K4.16 U5.A Q5.C
N$21
  Top 0.813: Q4.B arc-90 149.22,-296.55 RD4.1
N$22
  Top 0.813: Q4.C arc90 156.21,-297.18 D4.A
  Top 1.27: K3.16 U4.A Q4.C
N$23
  Top 0.813: Q3.B arc-90 160.66,-296.55 RD3.1
N$24
  Top 0.813: Q3.C arc90 167,-297.81 D3.A
  Top 1.27: K2.16 U3.A Q3.C
N$25
  Top 0.813: Q2.B arc-90 172.09,-296.55 RD2.1
N$26
  Bottom 1.422: X1.4 arc-90 182.25,-338.56 182.25,-320.68 K0.P1 K0.P2
N$27
  Bottom 1.422: X1.2 arc-90 171.45,-337.77 171.45,-320.68 K1.P2 K1.P1
N$28
  Bottom 1.422: X2.4 arc-90 159.38,-338.56 159.38,-320.68 K2.P2 K2.P1
N$29
  Bottom 1.422: X2.2 arc-90 148.59,-337.77 148.59,-320.68 K3.P2 K3.P1
N$30
  Bottom 1.422: K4.P1 136.53,-320.68 | 136.53,-320.68 K4.P2 | X3.4 arc-90 136.53,-338.56 136.53,-320.68
N$31
  Bottom 1.422: K5.P1 125.73,-320.68 | 125.73,-320.68 K5.P2 | X3.2 arc-90 125.73,-337.77 125.73,-320.68
N$32
  Bottom 1.422: K6.P2 113.67,-320.68 | 113.67,-320.68 K6.P1 | X4.4 arc-90 113.67,-338.56 113.67,-320.68
N$33
  Bottom 1.422: K7.P2 102.87,-320.68 | 102.87,-320.68 K7.P1 | X4.2 arc-90 102.87,-337.77 102.87,-320.68
N$34
  Top 1.422: X4.1 arc-90 98.42,-338.35 K7.S1 K7.S2
N$35  (1 unrouted)
N$36
  Top 1.422: X3.1 arc-90 121.28,-338.35 K5.S1 K5.S2
N$37
  Top 1.422: X3.3 arc-90 132.72,-339.78 K4.S1 K4.S2
N$38
  Top 1.422: X2.1 arc-90 144.15,-338.35 K3.S1 K3.S2
N$39
  Top 1.422: X2.3 arc-90 155.57,-339.78 K2.S1 K2.S2
N$40
  Top 1.422: X1.1 arc-90 167,-338.35 K1.S1 K1.S2
N$41
  Top 1.422: X1.3 arc-90 178.44,-339.78 K0.S1 K0.S2
N$42
  Top 1.422: X4.3 arc-90 109.86,-339.78 K6.S1 K6.S2
N$43  (1 unrouted)
N$44  (3 unrouted)
N$45  (1 unrouted)
N$46  (1 unrouted)
N$47  (1 unrouted)
N$52
  Top 0.813: Q8.C arc90 109.86,-297.81 D8.A
  Top 1.27: K7.16 U8.A Q8.C
N$54
  Top 0.813: Q7.B arc-90 114.94,-296.55 RD7.1
N$55  (1 unrouted)
N$56  (1 unrouted)
N$57  (1 unrouted)
N$58  (2 unrouted)
N$59  (2 unrouted)
N$60  (2 unrouted)
N$61  (4 unrouted)
N$62  (1 unrouted)
N$63  (1 unrouted)
N$64  (1 unrouted)
N$65  (1 unrouted)
N$66
  Top 0.813: Q2.C arc90 178.44,-297.81 D2.A
  Top 1.27: K1.16 U2.A Q2.C
N$67
  Top 0.813: Q1.B arc-90 183.51,-296.55 RD1.1
N$68
  Top 0.813: Q1.C arc90 189.23,-298.45 D1.A
  Top 1.27: K0.16 U1.A Q1.C
N$96
  Top 0.813: RL1.1 U1.K
N$163
  Top 0.813: RL8.1 U8.K
N$165
  Top 0.813: RL7.1 U7.K
N$169
  Top 0.813: RL6.1 U6.K
N$171
  Top 0.813: RL5.1 U5.K
N$174
  Top 0.813: RL4.1 U4.K
N$177
  Top 0.813: RL3.1 U3.K
N$180
  Top 0.813: RL2.1 U2.K
P-RESET  (1 unrouted)
PB0  (1 unrouted)
PB1  (1 unrouted)
PB4  (1 unrouted)
PB5  (1 unrouted)
PB6  (1 unrouted)
PB7  (1 unrouted)
PC0
  Top 0.813: IC1.22 165.74,-273.05 arc-90 165.1,-273.69 106.68,-273.69 arc90 103.5,-276.86 RD8.2
PC1
  Top 0.813: IC1.23 168.28,-274.32 arc-90 167.64,-274.95 116.84,-274.95 arc90 114.94,-276.86 RD7.2
PC2
  Top 0.813: IC1.24 170.81,-274.32 arc-90 168.91,-276.23 128.91,-276.23 arc90 126.36,-278.76 RD6.2
PC3
  Top 0.813: IC1.25 173.35,-275.59 arc-90 171.45,-277.5 139.7,-277.5 arc90 137.79,-279.4 RD5.2
PC4
  Top 0.813: RD4.2 149.22,-280.67 arc-90 151.13,-278.76 173.99,-278.76 arc90 175.9,-276.86 IC1.26
PC5
  Top 0.813: RD3.2 160.66,-281.94 arc-90 162.56,-280.04 175.9,-280.04 arc90 178.44,-277.5 IC1.27
PC6
  Top 0.813: RD2.2 172.09,-282.57 arc-90 173.35,-281.31 179.07,-281.31 arc90 180.97,-279.4 IC1.28
PC7
  Top 0.813: RD1.2 IC1.29
PE  (53 unrouted)
  Top 1.422: K7.1 98.42,-316.87 | 98.42,-316.87 109.86,-316.87 | 109.86,-316.87 121.28,-316.87 | 121.28,-316.87 132.72,-316.87 | 132.72,-316.87 144.15,-316.87 | 144.15,-316.87 155.57,-316.87 | 155.57,-316.87 167,-316.87 | 167,-316.87 177.8,-316.87 arc90 178.44,-316.23 K0.1 | K1.1 167,-316.87 | K2.1 155.57,-316.87 | K3.1 144.15,-316.87 | K4.1 132.72,-316.87 | K5.1 121.28,-316.87 | K6.1 109.86,-316.87 | X5.2 92.05,-323.24 arc-90 98.42,-316.87
  Bottom 0.813: K6.1 109.86,-298.45 arc-90 RL7.2 | RL8.2 arc90 98.42,-298.45 K7.1 | RL6.2 arc90 121.28,-298.45 K5.1 | RL5.2 arc90 132.72,-298.45 K4.1 | RL4.2 arc90 144.15,-298.45 K3.1 | RL3.2 arc90 155.57,-299.08 K2.1 | RL2.2 arc90 167,-298.45 K1.1 | K0.1 178.44,-298.45 arc-90 RL1.2 180.34,-293.37 arc-90 182.88,-290.83 188.59,-290.83 arc90 191.77,-287.65 191.77,-278.76 arc90 190.5,-277.5 189.87,-277.5 arc-90 188.59,-276.23 IC1.31
RST  (4 unrouted)
SCK  (1 unrouted)
VCC  (6 unrouted)